# Altium schematic sheet [05] - CPU EBI INTERFACE.SchDoc
size A4; DocumentNumber: 5; SheetNumber: 5; SheetTotal: 9
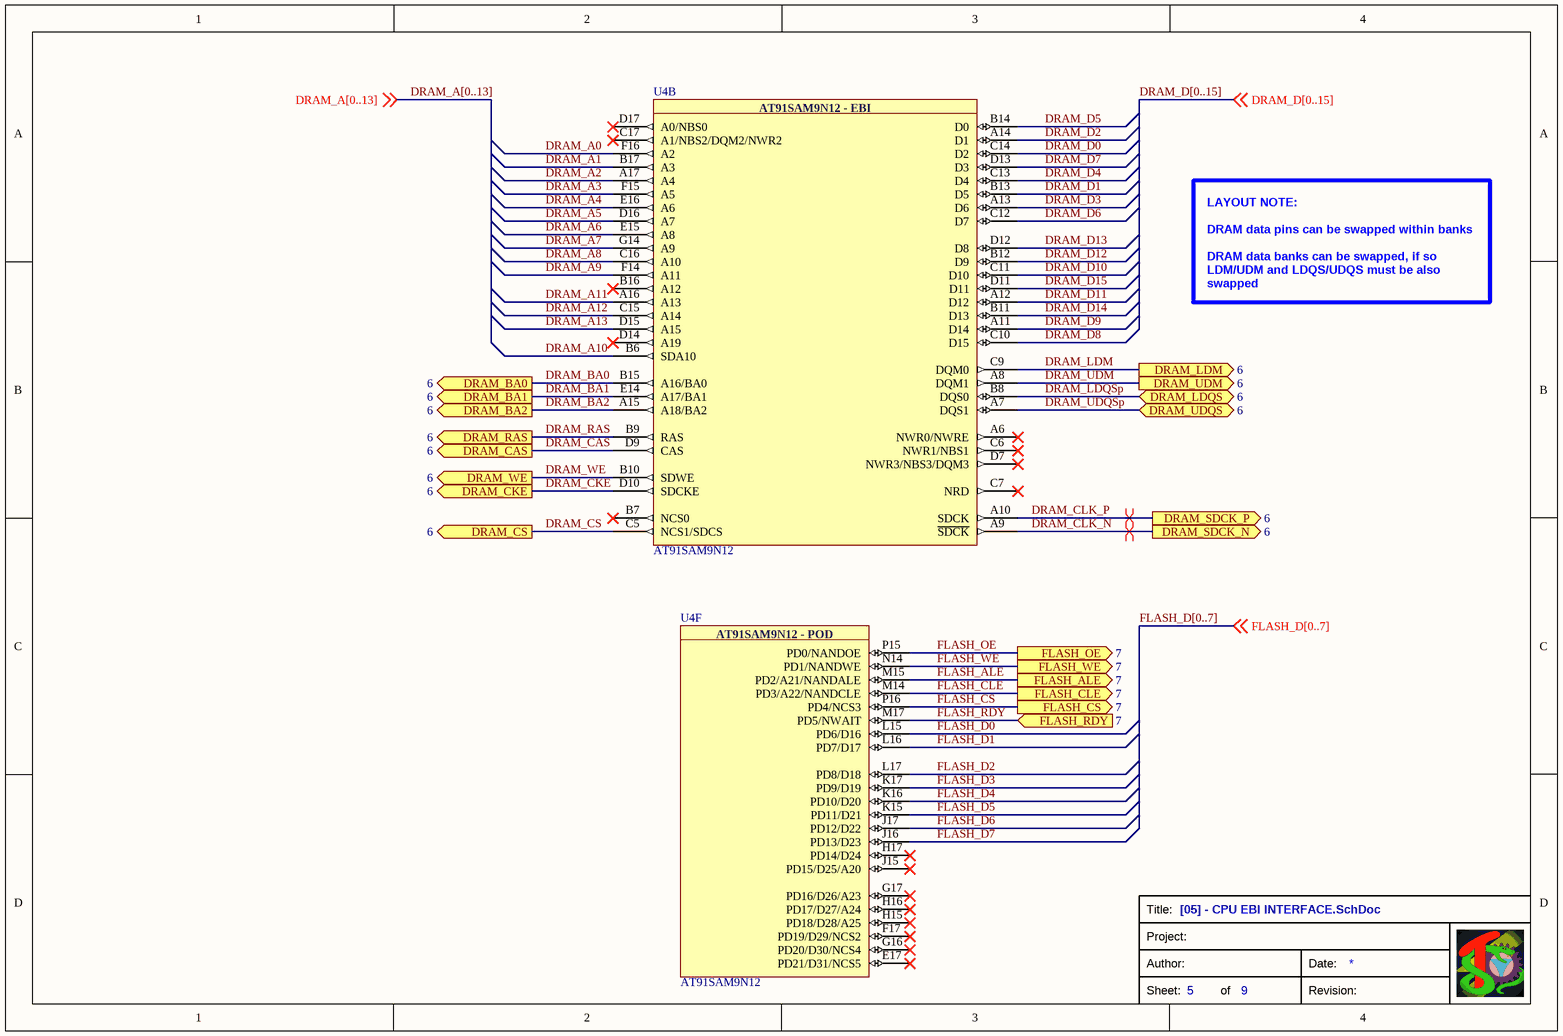
[diagram p0: [05] - CPU EBI INTERFACE.SchDoc]

## Parts
U4  AT91SAM9N12  [BGA0.8P17X17_217_15X15]  (parts B,F of 6)

## Ports
DRAM_BA0 (out, see 6), DRAM_BA1 (out, see 6), DRAM_BA2 (out, see 6), DRAM_CAS (out, see 6), DRAM_CKE (out, see 6), DRAM_CS (out, see 6), DRAM_LDM (out, see 6), DRAM_LDQS (bidir, see 6), DRAM_RAS (out, see 6), DRAM_SDCK_N (out, see 6), DRAM_SDCK_P (out, see 6), DRAM_UDM (out, see 6), DRAM_UDQS (bidir, see 6), DRAM_WE (out, see 6), FLASH_ALE (out, see 7), FLASH_CLE (out, see 7), FLASH_CS (out, see 7), FLASH_OE (out, see 7), FLASH_RDY (in, see 7), FLASH_WE (out, see 7)

## Nets
DRAM_A0: U4.F16(A2)
DRAM_A1: U4.B17(A3)
DRAM_A2: U4.A17(A4)
DRAM_A3: U4.F15(A5)
DRAM_A4: U4.E16(A6)
DRAM_A5: U4.D16(A7)
DRAM_A6: U4.E15(A8)
DRAM_A7: U4.G14(A9)
DRAM_A8: U4.C16(A10)
DRAM_A9: U4.F14(A11)
DRAM_A10: U4.B6(SDA10)
DRAM_A11: U4.A16(A13)
DRAM_A12: U4.C15(A14)
DRAM_A13: U4.D15(A15)
DRAM_BA0: U4.B15(A16/BA0) ; port DRAM_BA0
DRAM_BA1: U4.E14(A17/BA1) ; port DRAM_BA1
DRAM_BA2: U4.A15(A18/BA2) ; port DRAM_BA2
DRAM_CAS: U4.D9(CAS) ; port DRAM_CAS
DRAM_CKE: U4.D10(SDCKE) ; port DRAM_CKE
DRAM_CLK_N: U4.A9(~{SDCK}) ; port DRAM_SDCK_N
DRAM_CLK_P: U4.A10(SDCK) ; port DRAM_SDCK_P
DRAM_CS: U4.C5(NCS1/SDCS) ; port DRAM_CS
DRAM_D0: U4.C14(D2)
DRAM_D1: U4.B13(D5)
DRAM_D2: U4.A14(D1)
DRAM_D3: U4.A13(D6)
DRAM_D4: U4.C13(D4)
DRAM_D5: U4.B14(D0)
DRAM_D6: U4.C12(D7)
DRAM_D7: U4.D13(D3)
DRAM_D8: U4.C10(D15)
DRAM_D9: U4.A11(D14)
DRAM_D10: U4.C11(D10)
DRAM_D11: U4.A12(D12)
DRAM_D12: U4.B12(D9)
DRAM_D13: U4.D12(D8)
DRAM_D14: U4.B11(D13)
DRAM_D15: U4.D11
DRAM_LDM: U4.C9(DQM0) ; port DRAM_LDM
DRAM_LDQSp: U4.B8(DQS0) ; port DRAM_LDQS
DRAM_RAS: U4.B9(RAS) ; port DRAM_RAS
DRAM_UDM: U4.A8(DQM1) ; port DRAM_UDM
DRAM_UDQSp: U4.A7(DQS1) ; port DRAM_UDQS
DRAM_WE: U4.B10(SDWE) ; port DRAM_WE
FLASH_ALE: U4.M15(PD2/A21/NANDALE) ; port FLASH_ALE
FLASH_CLE: U4.M14(PD3/A22/NANDCLE) ; port FLASH_CLE
FLASH_CS: U4.P16(PD4/NCS3) ; port FLASH_CS
FLASH_D0: U4.L15(PD6/D16)
FLASH_D1: U4.L16(PD7/D17)
FLASH_D2: U4.L17(PD8/D18)
FLASH_D3: U4.K17(PD9/D19)
FLASH_D4: U4.K16(PD10/D20)
FLASH_D5: U4.K15(PD11/D21)
FLASH_D6: U4.J17(PD12/D22)
FLASH_D7: U4.J16(PD13/D23)
FLASH_OE: U4.P15(PD0/NANDOE) ; port FLASH_OE
FLASH_RDY: U4.M17(PD5/NWAIT) ; port FLASH_RDY
FLASH_WE: U4.N14(PD1/NANDWE) ; port FLASH_WE

Not connected (* = marked no-connect by the designer): U4 A6(NWR0/NWRE)* B7(NCS0)* B16(A12)* C6(NWR1/NBS1)* C7(NRD)* C17(A1/NBS2/DQM2/NWR2)* D7(NWR3/NBS3/DQM3)* D14(A19)* D17(A0/NBS0)* E17(PD21/D31/NCS5)* F17(PD19/D29/NCS2)* G16(PD20/D30/NCS4)* G17(PD16/D26/A23)* H15(PD18/D28/A25)* H16(PD17/D27/A24)* H17(PD14/D24)* J15(PD15/D25/A20)*

## Buses and harness runs
bus DRAM_A[0..13]
bus DRAM_D[0..15]
bus FLASH_D[0..7]

## Layout directives
differential pair; differential pair class DIFF100: DRAM_CLK_N, DRAM_CLK_P

## Notes on the sheet
- LAYOUT NOTE:
  DRAM data pins can be swapped within banks
  DRAM data banks can be swapped, if so LDM/UDM and LDQS/UDQS must be also swapped
- Title:
- Project:
- Sheet:
- Author:
- of
- Revision:
- Date:
- (in symbol AT91SAM9N12, part B) AT91SAM9N12 - EBI
- (in symbol AT91SAM9N12, part F) AT91SAM9N12 - POD

## Library data of the parts
U4 = AT91SAM9N12: MPU ARM926EJ-S 400MHz; Supplier 1: Mouser; Supplier Part Number 1: 556-AT91SAM9N12-CU